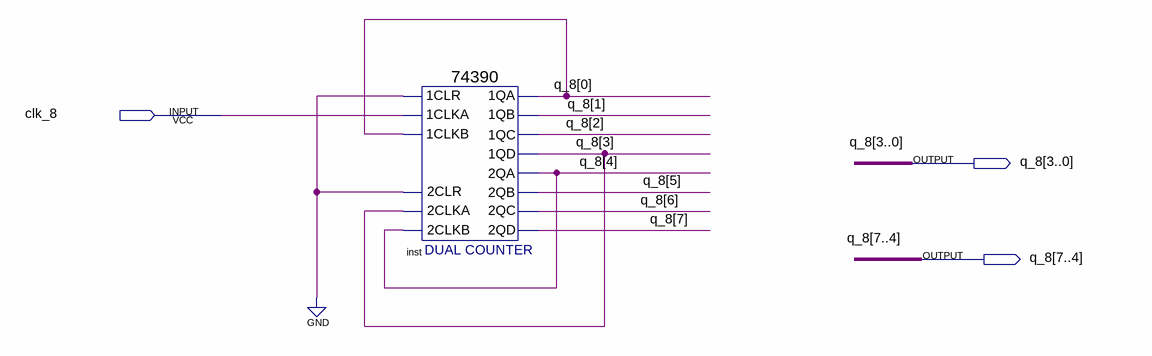
[diagram p0: schematic sheet]
// Quartus schematic cnt100_8.bdf as structural Verilog: 1 symbols, 3 pins
module cnt100_8 (
  input  clk_8,
  output [7:0] q_8
);

  \74390  inst (
    .\2CLKA (q_8[3]), .\2CLR (1'b0), .\2CLKB (q_8[4]), .\1CLR (1'b0), .\1CLKA (clk_8), .\1CLKB (q_8[0]),
    .\1QA (q_8[0]), .\1QB (q_8[1]), .\1QC (q_8[2]), .\1QD (q_8[3]), .\2QA (q_8[4]), .\2QB (q_8[5]),
    .\2QC (q_8[6]), .\2QD (q_8[7]));
endmodule
